# EAGLE design Ffrydiau_core (EAGLE 9.6.2)
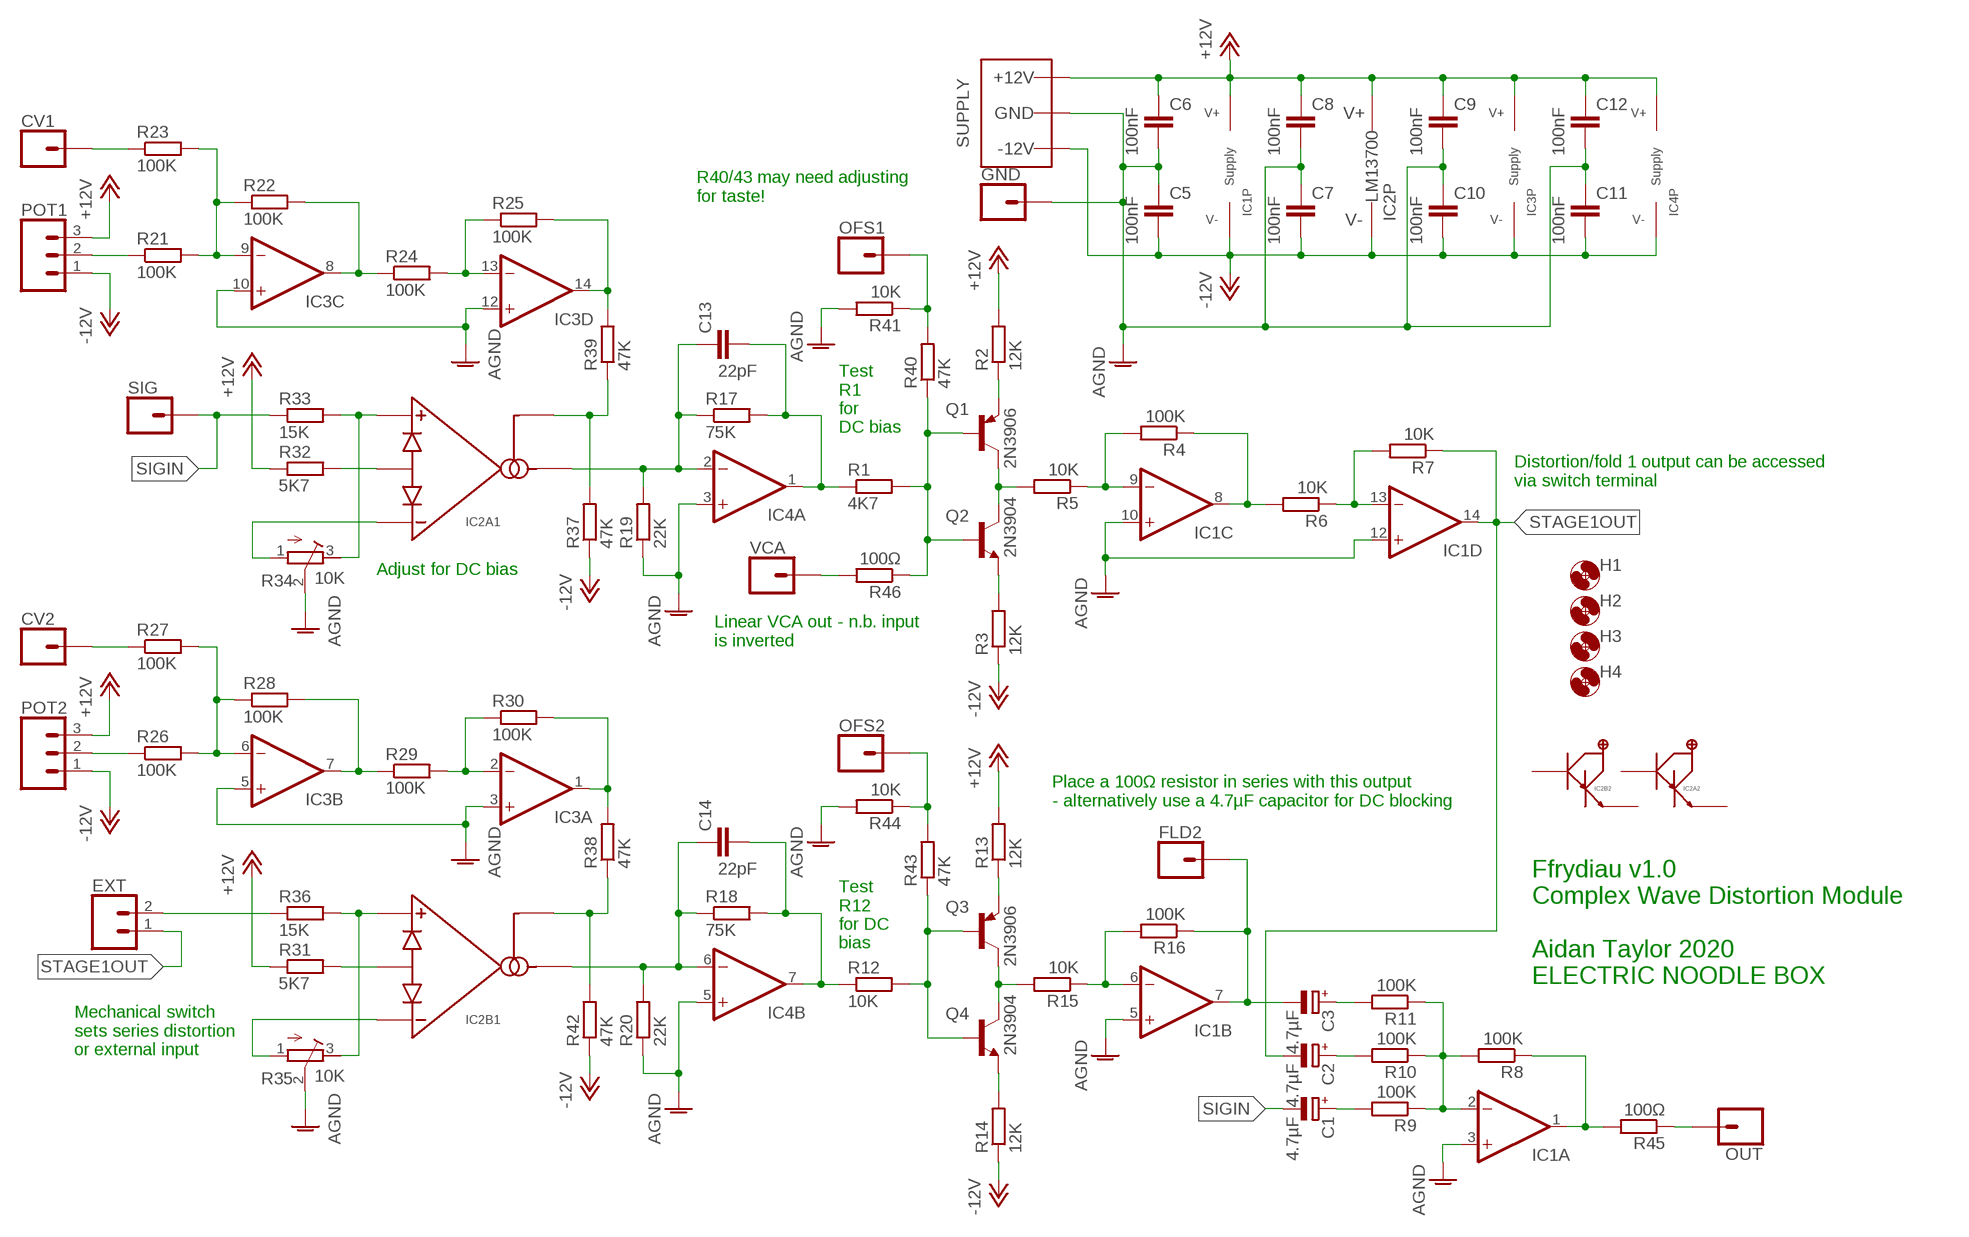
[diagram p0: schematic, sheet 1]

## Parts
C1  4.7µF  CPOL-EUE2,5-6E  [E2,5-6E]
C2  4.7µF  CPOL-EUE2,5-6E  [E2,5-6E]
C3  4.7µF  CPOL-EUE2,5-6E  [E2,5-6E]
C5  100nF  C-EU050-025X075  [C050-025X075]
C6  100nF  C-EU050-025X075  [C050-025X075]
C7  100nF  C-EU050-025X075  [C050-025X075]
C8  100nF  C-EU050-025X075  [C050-025X075]
C9  100nF  C-EU050-025X075  [C050-025X075]
C10  100nF  C-EU050-025X075  [C050-025X075]
C11  100nF  C-EU050-025X075  [C050-025X075]
C12  100nF  C-EU050-025X075  [C050-025X075]
C13  22pF  C-EU050-025X075  [C050-025X075]
C14  22pF  C-EU050-025X075  [C050-025X075]
CV1  1XWIREPAD  [1X01]
CV2  1XWIREPAD  [1X01]
EXT  2XWIREPAD  [1X02]
FLD2  1XWIREPAD  [1X01]
GND  1XWIREPAD  [1X01]
H1  MOUNT-HOLE3.2  [3,2]
H2  MOUNT-HOLE3.2  [3,2]
H3  MOUNT-HOLE3.2  [3,2]
H4  MOUNT-HOLE3.2  [3,2]
IC1  TL0X4DIL  [DIL14]
IC2  LM13700DIL  [DIL16]
IC3  TL0X4DIL  [DIL14]
IC4  TL0X2DIL  [DIL08]
OFS1  1XWIREPAD  [1X01]
OFS2  1XWIREPAD  [1X01]
OUT  1XWIREPAD  [1X01]
POT1  3XWIREPAD  [1X03]
POT2  3XWIREPAD  [1X03]
Q1  2N3906  [TO92]
Q2  2N3904  [TO92]
Q3  2N3906  [TO92]
Q4  2N3904  [TO92]
R1  4K7  R-EU_0207/10  [0207/10]
R2  12K  R-EU_0207/10  [0207/10]
R3  12K  R-EU_0207/10  [0207/10]
R4  100K  R-EU_0207/10  [0207/10]
R5  10K  R-EU_0207/10  [0207/10]
R6  10K  R-EU_0207/10  [0207/10]
R7  10K  R-EU_0207/10  [0207/10]
R8  100K  R-EU_0207/10  [0207/10]
R9  100K  R-EU_0207/10  [0207/10]
R10  100K  R-EU_0207/10  [0207/10]
R11  100K  R-EU_0207/10  [0207/10]
R12  10K  R-EU_0207/10  [0207/10]
R13  12K  R-EU_0207/10  [0207/10]
R14  12K  R-EU_0207/10  [0207/10]
R15  10K  R-EU_0207/10  [0207/10]
R16  100K  R-EU_0207/10  [0207/10]
R17  75K  R-EU_0207/10  [0207/10]
R18  75K  R-EU_0207/10  [0207/10]
R19  22K  R-EU_0207/10  [0207/10]
R20  22K  R-EU_0207/10  [0207/10]
R21  100K  R-EU_0207/10  [0207/10]
R22  100K  R-EU_0207/10  [0207/10]
R23  100K  R-EU_0207/10  [0207/10]
R24  100K  R-EU_0207/10  [0207/10]
R25  100K  R-EU_0207/10  [0207/10]
R26  100K  R-EU_0207/10  [0207/10]
R27  100K  R-EU_0207/10  [0207/10]
R28  100K  R-EU_0207/10  [0207/10]
R29  100K  R-EU_0207/10  [0207/10]
R30  100K  R-EU_0207/10  [0207/10]
R31  5K7  R-EU_0207/10  [0207/10]
R32  5K7  R-EU_0207/10  [0207/10]
R33  15K  R-EU_0207/10  [0207/10]
R34  10K  R-TRIMM3296W  [RTRIM3296W]
R35  10K  R-TRIMM3296W  [RTRIM3296W]
R36  15K  R-EU_0207/10  [0207/10]
R37  47K  R-EU_0207/10  [0207/10]
R38  47K  R-EU_0207/10  [0207/10]
R39  47K  R-EU_0207/10  [0207/10]
R40  47K  R-EU_0207/10  [0207/10]
R41  10K  R-EU_0207/10  [0207/10]
R42  47K  R-EU_0207/10  [0207/10]
R43  47K  R-EU_0207/10  [0207/10]
R44  10K  R-EU_0207/10  [0207/10]
R45  100Ω  R-EU_0207/10  [0207/10]
R46  100Ω  R-EU_0207/10  [0207/10]
SIG  1XWIREPAD  [1X01]
VCA  1XWIREPAD  [1X01]
WP1  COMBO_SUPPLY_HEADER  [COMBINED_POWER]

## Nets
+12V: C6.1 C8.1 C9.1 C12.1 IC1.4(P:V+) IC2.11(P:V+) IC3.4(P:V+) IC4.8(P:V+) POT1.3 POT2.3 R2.2 R13.2 R31.1 R32.1 WP1.V+1(V++) WP1.V+2(V++) WP1.V+3(V++)
-12V: C5.2 C7.2 C10.2 C11.2 IC1.11(P:V-) IC2.6(P:V-) IC3.11(P:V-) IC4.4(P:V-) POT1.1 POT2.1 R3.1 R14.1 R37.1 R42.1 WP1.V-1(V--) WP1.V-2(V--) WP1.V-3(V--)
AGND: C5.1 C6.2 C7.1 C8.2 C9.2 C10.1 C11.1 C12.2 GND.1 IC1.3(A:+IN) IC1.5(B:+IN) IC1.10(C:+IN) IC1.12(D:+IN) IC3.3(A:+IN) IC3.5(B:+IN) IC3.10(C:+IN) IC3.12(D:+IN) IC4.3(A:+IN) IC4.5(B:+IN) R19.1 R20.1 R34.2(S) R35.2(S) R41.2 R44.2 WP1.GND1(AGND) WP1.GND2(AGND) WP1.GND3(AGND) WP1.GND4(AGND) WP1.GND5(AGND) WP1.GND6(AGND) WP1.GND7(AGND) WP1.GND8(AGND)
N$1: Q1.2(B) Q2.2(B) R1.2 R40.1 R46.1
N$2: Q1.3(E) R2.1
N$3: Q2.3(E) R3.2
N$4: Q1.1(C) Q2.1(C) R5.2
N$5: IC1.9(C:-IN) R4.2 R5.1
N$6: IC1.8(C:OUT) R4.1 R6.2
N$7: IC1.13(D:-IN) R6.1 R7.2
N$8: OUT.1 R45.1
N$9: C13.2 IC4.1(A:OUT) R1.1 R17.2
N$10: C3.+ R11.2
N$11: C2.+ R10.2
N$12: C1.+ R9.2
N$13: IC1.2(A:-IN) R8.2 R9.1 R10.1 R11.1
N$14: IC1.1(A:OUT) R8.1 R45.2
N$15: Q3.2(B) Q4.2(B) R12.2 R43.1
N$16: Q3.3(E) R13.1
N$17: Q4.3(E) R14.2
N$18: Q3.1(C) Q4.1(C) R15.2
N$19: IC1.6(B:-IN) R15.1 R16.2
N$20: C3.- FLD2.1 IC1.7(B:OUT) R16.1
N$21: C14.1 IC2.12(B1:AMPOUT) IC4.6(B:-IN) R18.1 R20.2
N$22: C13.1 IC2.5(A1:AMPOUT) IC4.2(A:-IN) R17.1 R19.2
N$23: C14.2 IC4.7(B:OUT) R12.1 R18.2
N$24: IC3.9(C:-IN) R21.2 R22.1 R23.2
N$25: IC3.8(C:OUT) R22.2 R24.1
N$26: IC3.13(D:-IN) R24.2 R25.1
N$27: IC3.14(D:OUT) R25.2 R39.2
N$28: CV2.1 R27.1
N$29: IC3.1(A:OUT) R30.2 R38.2
N$30: POT1.2 R21.1
N$31: IC3.2(A:-IN) R29.2 R30.1
N$32: CV1.1 R23.1
N$33: IC3.7(B:OUT) R28.2 R29.1
N$34: IC3.6(B:-IN) R26.2 R27.2 R28.1
N$35: IC2.14(B1:AMP+) R35.3(E) R36.2
N$36: IC2.13(B1:AMP-) R35.1(A)
N$37: IC2.15(B1:DIODES) R31.2
N$38: IC2.2(A1:DIODES) R32.2
N$39: IC2.1(A1:AMPBIAS) R37.2 R39.1
N$40: POT2.2 R26.1
N$41: IC2.3(A1:AMP+) R33.2 R34.3(E)
N$42: IC2.4(A1:AMP-) R34.1(A)
N$43: IC2.16(B1:AMPBIAS) R38.1 R42.2
N$44: OFS1.1 R40.2 R41.1
N$45: OFS2.1 R43.2 R44.1
N$46: R46.2 VCA.1
N$47: EXT.2 R36.1
SIGIN: C1.- R33.1 SIG.1
STAGE1OUT: C2.- EXT.1 IC1.14(D:OUT) R7.1
Unconnected: IC2.7(A2:BUFF_IN) IC2.8(A2:BUFF_OUT) IC2.9(B2:BUFF_OUT) IC2.10(B2:BUFF_IN)

## Notes on the sheet
- R40/43 may need adjusting 
  for taste!
- Test
  R1
  for
  DC bias
- Distortion/fold 1 output can be accessed
  via switch terminal
- Adjust for DC bias
- Linear VCA out - n.b. input
  is inverted
- Place a 100Ω resistor in series with this output
  - alternatively use a 4.7µF capacitor for DC blocking
- Test
  R12
  for DC
  bias
- Ffrydiau v1.0
  Complex Wave Distortion Module
  
  Aidan Taylor 2020 
  ELECTRIC NOODLE BOX
- Mechanical switch
  sets series distortion
  or external input

## Library data of the parts
C1-C3 = rcl:CPOL-EU: POLARIZED CAPACITOR, European symbol; SPICEPREFIX: C
C5-C14 = rcl:C-EU: CAPACITOR, European symbol; SPICEPREFIX: C
CV1 CV2 FLD2 GND OFS1 OFS2 OUT SIG VCA = ElectricNoodleBox:1XWIREPAD
EXT = ElectricNoodleBox:2XWIREPAD
H1-H4 = holes:MOUNT-HOLE: MOUNTING HOLE with drill center marker
IC1 IC3 = ElectricNoodleBox:TL0X4: Quad Operational Amplifier; CATALOGUE: 3005140; RETAILER: Farnell
IC2 = ElectricNoodleBox:LM13700: Dual Transconductance Amplifier with Darlington Buffer; CATALOGUE: 3118206; RETAILER: Farnell
IC4 = ElectricNoodleBox:TL0X2: Dual Operational Amplifier; CATALOGUE: 1103189; RETAILER: Farnell
POT1 POT2 = ElectricNoodleBox:3XWIREPAD
Q1 Q3 = transistor-pnp:2N3906: PNP Transistor
Q2 Q4 = transistor-npn:2N3904: NPN Transistor
R1-R33 R36-R46 = rcl:R-EU_: RESISTOR, European symbol; SPICEPREFIX: R
R34 R35 = rcl:R-TRIMM: Trimm resistor; SPICEMODEL: X; SPICEPREFIXL: POT
WP1 = ElectricNoodleBox:COMBO_SUPPLY_HEADER

## Board
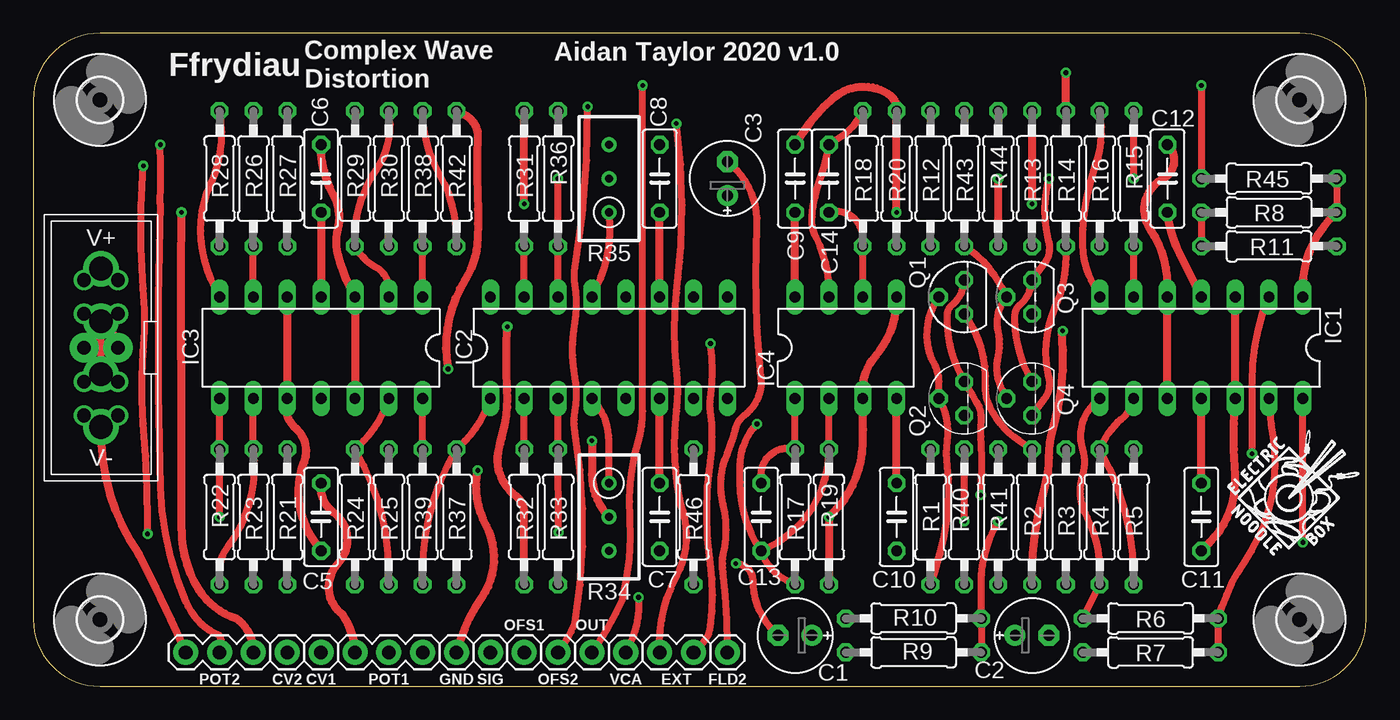
[diagram p1: board, top side]
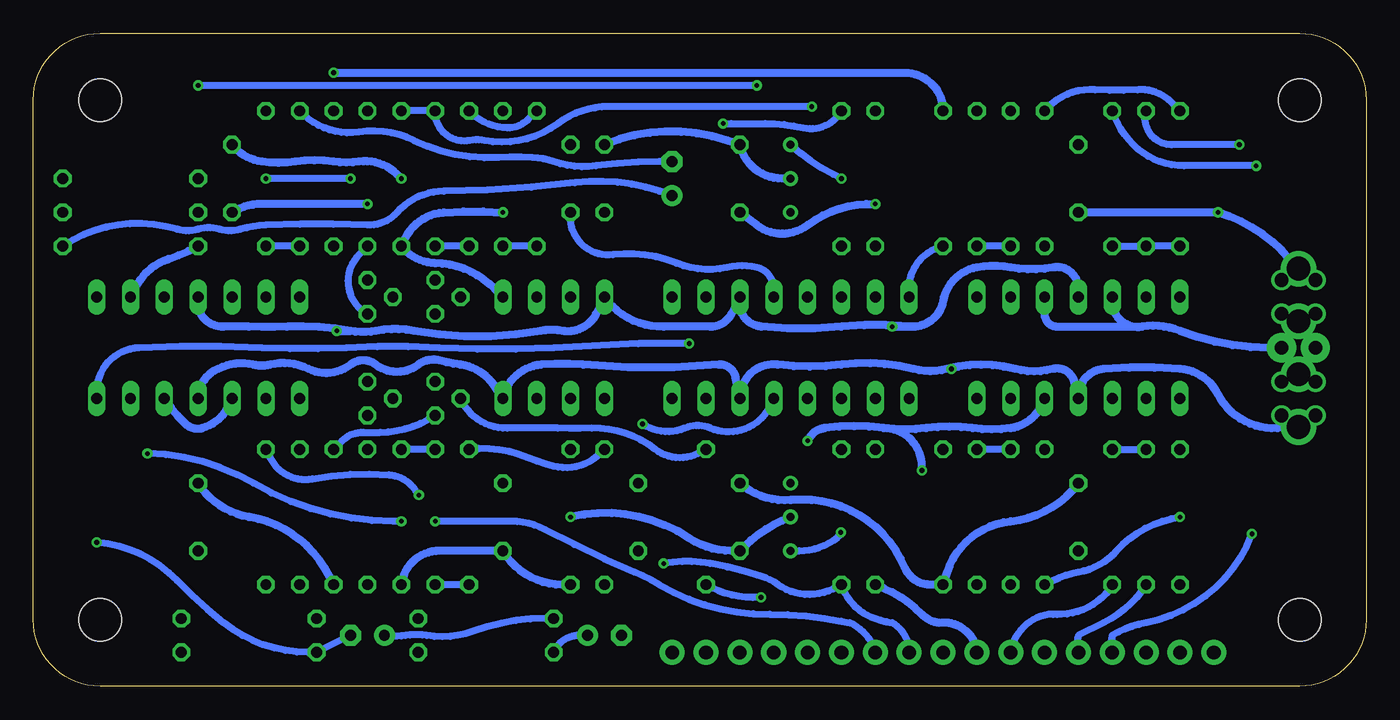
[diagram p2: board, bottom side, seen from below]

Size 100 x 49 mm. Coordinates in mm from the lower left corner, seen from the top.
Outline: 0,44 0,5 arc90 5,0 95,0 arc90 100,5 100,44 arc90 95,49 5,49 arc90 0,44
Copper layers (1*16): Top 0.035mm / dielectric 1.5mm / Bottom 0.035mm
Design rules "default": minimum track width 6mil, minimum drill 0.35mm, track to track 6mil, track to pad 6mil, pad to pad 6mil, via to via 6mil, smd to smd 6mil, copper to edge 40mil, drill to drill 6mil, minimum pad ring 10mil, minimum via ring 8mil, stop-mask expansion 4mil, vias tented up to drill 0mil, thermal gap 10mil

### Footprints (pad centres in the part's own frame; a part is rotated, then mirrored left to right if it is on the bottom)
E2,5-6E = drill 0.813 pad 1.575: + -1.27,0 | drill 0.813 pad 1.575 octagon: - 1.27,0
C050-025X075 = drill 0.813 octagon: 1 -2.54,0; 2 2.54,0
1X01 = drill 1.016 pad 1.88: 1 0,0
1X02 = drill 1.016 pad 1.88: 1 0,0; 2 2.54,0
3,2 = hole 3.2: 0,0
DIL14 = drill 0.813 long: 1 -7.62,-3.81; 2 -5.08,-3.81; 3 -2.54,-3.81; 4 0,-3.81; 5 2.54,-3.81; 6 5.08,-3.81; 7 7.62,-3.81; 8 7.62,3.81; 9 5.08,3.81; 10 2.54,3.81; 11 0,3.81; 12 -2.54,3.81; 13 -5.08,3.81; 14 -7.62,3.81
DIL16 = drill 0.813 long: 1 -8.89,-3.81; 2 -6.35,-3.81; 3 -3.81,-3.81; 4 -1.27,-3.81; 5 1.27,-3.81; 6 3.81,-3.81; 7 6.35,-3.81; 8 8.89,-3.81; 9 8.89,3.81; 10 6.35,3.81; 11 3.81,3.81; 12 1.27,3.81; 13 -1.27,3.81; 14 -3.81,3.81; 15 -6.35,3.81; 16 -8.89,3.81
DIL08 = drill 0.813 long: 1 -3.81,-3.81; 2 -1.27,-3.81; 3 1.27,-3.81; 4 3.81,-3.81; 5 3.81,3.81; 6 1.27,3.81; 7 -1.27,3.81; 8 -3.81,3.81
1X03 = drill 1.016 pad 1.88: 1 0,0; 2 2.54,0; 3 5.08,0
TO92 = drill 0.813 octagon: 1 1.27,0; 2 0,1.905; 3 -1.27,0
0207/10 = drill 0.813 octagon: 1 -5.08,0; 2 5.08,0
RTRIM3296W = drill 0.61: 1 0,-2.54; 2 0,0; 3 0,2.54
COMBINED_POWER = drill 1.78: GND1 -1.98,0; GND2 1.98,0; V+1 -5.94,0; V-1 5.94,0 | drill 1.016: GND3 -2.54,1.27; GND5 2.54,1.27; GND6 -2.54,-1.27; GND8 2.54,-1.27; V+2 -5.08,1.27; V+3 -5.08,-1.27; V-2 5.08,1.27; V-3 5.08,-1.27 | drill 1.016 pad 2.184: GND4 0,1.27; GND7 0,-1.27

### Placement (x,y rotation side)
C1  57.15,3.81 180 top
C2  74.93,3.81 0 top
C3  52.07,38.1 90 top
C5  21.59,12.7 90 top
C6  21.59,38.1 90 top
C7  46.99,12.7 90 top
C8  46.99,38.1 90 top
C9  57.15,38.1 90 top
C10  64.77,12.7 90 top
C11  87.63,12.7 90 top
C12  85.09,38.1 90 top
C13  54.61,12.7 90 top
C14  59.69,38.1 90 top
CV1  21.59,2.54 90 top
CV2  19.05,2.54 90 top
EXT  49.53,2.54 180 top
FLD2  52.07,2.54 90 top
GND  31.75,2.54 90 top
H1  95,44 0 top
H2  95,5 0 top
H3  5,44 0 top
H4  5,5 0 top
IC1  87.63,25.4 180 top
IC2  43.18,25.4 0 top
IC3  21.59,25.4 180 top
IC4  60.96,25.4 0 top
OFS1  36.83,2.54 270 top
OFS2  39.37,2.54 90 top
OUT  41.91,2.54 270 top
POT1  24.13,2.54 0 top
POT2  11.43,2.54 0 top
Q1  69.85,29.21 90 top
Q2  69.85,21.59 90 top
Q3  74.93,29.21 90 top
Q4  74.93,21.59 90 top
R1  20K  [0207/10]  67.31,12.7 270 top
R2  74.93,12.7 270 top
R3  77.47,12.7 90 top
R4  80.01,12.7 90 top
R5  82.55,12.7 90 top
R6  83.82,5.08 180 top
R7  83.82,2.54 0 top
R8  92.71,35.56 180 top
R9  66.04,2.54 180 top
R10  66.04,5.08 180 top
R11  92.71,33.02 0 top
R12  20K  [0207/10]  67.31,38.1 270 top
R13  74.93,38.1 90 top
R14  77.47,38.1 270 top
R15  82.55,38.1 90 top
R16  47K  [0207/10]  80.01,38.1 270 top
R17  57.15,12.7 90 top
R18  62.23,38.1 90 top
R19  59.69,12.7 90 top
R20  64.77,38.1 270 top
R21  19.05,12.7 90 top
R22  13.97,12.7 90 top
R23  16.51,12.7 90 top
R24  24.13,12.7 90 top
R25  26.67,12.7 90 top
R26  16.51,38.1 270 top
R27  19.05,38.1 270 top
R28  13.97,38.1 90 top
R29  24.13,38.1 270 top
R30  26.67,38.1 270 top
R31  36.83,38.1 270 top
R32  36.83,12.7 90 top
R33  39.37,12.7 90 top
R34  43.18,12.7 180 top
R35  43.18,38.1 0 top
R36  39.37,38.1 270 top
R37  31.75,12.7 90 top
R38  29.21,38.1 270 top
R39  29.21,12.7 90 top
R40  69.85,12.7 90 top
R41  72.39,12.7 270 top
R42  31.75,38.1 270 top
R43  69.85,38.1 90 top
R44  72.39,38.1 270 top
R45  92.71,38.1 0 top
R46  49.53,12.7 270 top
SIG  34.29,2.54 90 top
U$1  [LOGO10X10]  89.53,9.53 0 top
VCA  44.45,2.54 90 top
WP1  5.08,25.4 270 top

### Tracks (layer width: path | path; a pad name or v marks a point on that pad's centre or on a via)
+12V  (via drill 0.35)
  Top 0.508: WP1.V+2 5.94,30.48 WP1.V+1 4.22,30.48 WP1.V+3
  Top 0.61: v11.11,35.56 arc1 11.11,22.23 arc-1 11.11,11.75 arc33 12.38,7.3 arc40 15.24,5.08 arc-54 POT2.3 | C6.1 IC3.4 | R2.2 74.93,8.26 arc-16 75.88,14.92 arc16 76.2,17.14 arc-16 76.52,19.37 arc23 77.15,26.67 arc-203 v77.23,26.66 | IC2.11 C8.1 | IC4.8 C9.1 | C12.1 arc20 86.04,32.38 IC1.4 | v36.83,36.2 R31.1 | R13.2 v74.93,36.2 | R32.1 36.83,13.02 arc53 36.2,14.29 arc-66 34.92,17.78 arc-2 35.24,19.05 arc18 35.56,22.23 arc-7 v35.56,26.99
  Bottom 0.61: C6.1 v11.11,35.56 arc32 5.71,32.07 WP1.V+1 | R32.1 arc25 33.34,5.4 arc-37 32.07,4.76 arc93 POT1.3 | IC3.4 21.59,29.84 arc-100 23.5,31.43 arc21 26.67,31.43 arc-21 29.21,31.43 arc-69 31.75,28.89 arc85 34.29,26.99 | 34.29,26.99 arc-12 39.37,26.99 arc12 45.4,26.99 arc97 IC2.11 47.62,27.94 arc65 49.21,26.99 arc-3 52.7,26.99 arc56 IC4.8 57.78,27.94 arc74 60.33,26.67 arc-21 61.91,26.67 arc21 71.44,26.67 arc-21 74.3,26.67 arc21 76.2,26.67 | 76.2,26.67 arc-13 80.96,26.99 arc5 83.82,26.99 arc-5 85.72,26.99 arc104 IC1.4 | v77.23,26.66 76.2,26.67 | C8.1 45.72,34.61 arc-74 41.91,34.61 arc39 v36.83,36.2 | v74.93,36.2 82.87,36.2 arc-32 C12.1 | v35.56,26.99 34.29,26.99
-12V  (via drill 0.35)
  Top 0.508: WP1.V-1 4.67,19.46 WP1.V-3
  Top 0.61: WP1.V-1 arc36 7.94,9.84 arc-3 POT2.1 | C5.2 arc60 22.54,13.02 arc-97 22.86,9.21 arc97 23.18,5.4 arc-31 POT1.1 | C7.2 IC2.6 | C10.2 IC4.4 | C11.2 IC1.11 | R42.1 32.38,42.86 arc-65 33.34,41.27 arc3 33.34,36.83 arc-3 33.34,33.66 arc-30 32.38,30.48 arc42 v31.11,23.81 | R14.1 v77.47,46.04
  Bottom 0.61: C5.2 arc47 26.67,12.38 arc-66 31.43,8.57 R37.1 32.7,7.62 arc67 34.61,8.89 arc-63 41.59,13.97 arc-9 43.18,13.97 arc46 C7.2 | WP1.V-2 WP1.V-1 6.67,19.37 arc66 11.11,21.91 arc-58 13.97,23.81 arc-9 19.68,23.81 arc-90 IC3.11 21.91,22.86 arc-90 23.5,23.81 arc28 26.35,23.81 arc-28 31.43,23.81 | 31.43,23.81 arc28 33.97,23.81 arc-21 39.37,24.13 arc15 44.13,24.13 arc-98 IC2.6 47.31,23.18 arc-84 48.58,24.13 arc10 58.74,24.13 arc-10 61.91,24.13 arc-73 IC4.4 65.41,22.54 arc-49 67.94,24.13 arc7 69.53,24.45 arc-52 71.12,24.13 arc75 74.3,24.13 arc-75 76.2,24.13 arc64 79.38,23.81 arc-40 82.23,24.13 arc27 83.5,24.13 arc-49 86.68,23.5 arc-55 IC1.11 | R3.1 77.79,8.26 arc-54 83.82,12.7 arc49 C11.2 | v31.11,23.81 31.43,23.81 | v77.47,46.04 34.61,46.04 arc90 R42.1
AGND  (via drill 0.35)
  Top 0.508: WP1.GND2 4.52,22.86 WP1.GND8 | WP1.GND2 5.79,23.42 WP1.GND5 | WP1.GND2 WP1.GND1 | WP1.GND1 6.35,26.11 WP1.GND4 | WP1.GND1 5.08,26.67 WP1.GND7 | WP1.GND1 4.37,27.38 WP1.GND6 | WP1.GND1 5.79,27.38 WP1.GND3
  Top 0.61: C5.1 20.95,11.11 arc-55 20.32,16.83 arc70 19.68,19.37 arc-66 IC3.10 IC3.5 | R19.1 v59.69,12.7 60.01,13.02 arc43 62.23,18.1 arc5 IC4.3 62.23,22.23 arc-41 63.18,24.77 arc43 IC4.5 | IC3.12 IC3.3 23.81,29.84 arc-12 22.86,32.38 arc-29 22.86,34.29 arc43 22.54,36.83 arc-30 C6.2 | R34.2 arc-44 41.91,15.88 v41.91,18.41 | C11.1 88.27,10.79 arc49 90.17,15.88 arc-8 IC1.12 IC1.3 | IC1.10 IC1.5 85.09,30.16 arc34 83.82,34.29 arc-96 84.77,38.1 arc110 C12.2 | v64.77,35.56 R20.1 arc62 64.14,44.45 arc74 60.01,44.13 arc15 57.78,41.59 C9.2 | R44.2 v72.39,38.1 | GND.1 32.07,3.49 arc-16 33.66,6.67 arc63 33.97,12.06 arc-38 v33.34,16.19
  Bottom 0.61: R34.2 arc-25 46.67,10.48 C7.1 47.62,10.16 arc33 50.8,11.11 arc-47 v59.69,12.7 | R19.1 60.33,7.62 arc59 C10.1 69.53,10.16 arc-83 R41.2 | WP1.GND4 7.3,25.4 arc22 13.97,26.67 arc-30 16.83,26.99 | IC3.5 arc-108 16.83,26.99 | IC3.3 24.13,27.94 arc-90 23.18,26.99 16.83,26.99 | IC3.12 24.45,20.95 arc56 26.67,19.37 arc15 29.53,19.37 arc-15 33.02,19.37 arc15 36.2,19.37 | 36.2,19.37 arc-15 40.64,19.37 arc-58 v41.91,18.41 | IC1.10 85.41,20.95 arc47 87.31,19.37 arc60 88.58,19.68 arc12 IC1.12 | IC4.5 65.41,29.84 arc-44 69.85,31.75 arc50 R44.2 72.07,33.66 arc59 69.22,35.56 arc8 v64.77,35.56 | R35.2 43.81,38.1 arc77 C8.2 47.94,40.96 arc-41 C9.2 | v72.39,38.1 72.71,38.42 arc-53 75.56,39.37 arc16 77.47,39.37 arc-16 80.33,39.37 arc16 82.87,39.37 arc43 C12.2 | v33.34,16.19 33.34,16.51 arc-90 36.2,19.37
N$1
  Top 0.508: R1.2 67.63,8.57 arc11 68.58,12.7 arc15 68.58,16.51 arc-15 68.58,18.41 arc38 Q2.2 67.94,22.86 arc28 67.63,24.13 arc-63 Q1.2
  Bottom 0.508: R1.2 R40.1 | R46.1 50.16,17.46 arc65 53.34,17.78 arc-39 58.1,19.37 arc2 60.64,19.37 arc-2 64.45,19.37 arc67 Q2.2
N$2
  Top 0.508: R2.1 73.98,18.41 arc-30 71.75,20.95 arc-30 71.44,22.54 arc40 Q1.3
N$3
  Bottom 0.508: R3.2 76.83,18.41 arc46 75.25,19.05 arc-3 73.98,19.05 arc-31 Q2.3
N$4  (via drill 0.35)
  Top 0.508: v71.08,14.35 71.12,15.24 arc6 71.12,18.1 arc-6 71.12,20 arc34 70.8,21.27 arc0 Q2.1 69.53,23.5 arc-29 68.58,27.94 arc-48 68.9,28.57 arc48 Q1.1
  Bottom 0.508: R5.2 82.23,17.14 arc-74 79.06,15.56 arc14 73.34,15.88 arc63 71.12,14.29 arc-243 v71.08,14.35
N$5
  Top 0.508: R5.1 82.55,8.26 arc30 R4.2 80.33,18.41 arc-24 81.6,20 arc40 IC1.9
N$6
  Top 0.508: R6.2 R4.1 80.01,8.89 arc28 79.06,12.7 arc-45 78.74,15.88 arc33 78.74,17.78 arc-70 IC1.8
N$7
  Top 0.508: R7.2 R6.1 89.22,6.03 arc-16 90.81,9.21 arc43 93.03,18.73 arc-4 IC1.13
N$8  (via drill 0.35)
  Top 0.508: v45.72,45.09 45.72,20.64 arc-16 45.4,18.41 arc20 44.77,12.7 arc-17 44.2,6.47 arc-9 42.55,3.49 OUT.1 | v87.63,45.09 R45.1
  Bottom 0.508: v45.72,45.09 v87.63,45.09
N$9
  Top 0.508: C13.2 54.61,15.88 arc-106 R17.2 IC4.1
  Bottom 0.508: R17.2 57.47,17.46 arc59 60.96,16.51 arc8 62.87,17.14 arc-29 R1.1
N$10
  Bottom 0.508: C3.+ 53.02,37.15 arc-25 59.37,37.78 arc7 69.22,37.15 arc-48 72.71,35.56 arc51 74.93,34.61 arc-4 82.55,34.61 arc-15 84.45,34.29 arc34 86.04,34.29 arc-34 87.63,34.29 arc34 89.22,34.29 arc-50 R11.2
N$11
  Bottom 0.508: R10.2 61.59,5.08 arc-20 66.99,4.13 arc30 70.48,3.81 arc-19 72.07,3.81 arc19 C2.+
N$12
  Bottom 0.508: C1.+ 59.05,3.81 arc-67 R9.2
N$13  (via drill 0.35)
  Top 0.508: R9.1 R10.1 71.12,7.62 arc-31 v72.39,12.38 | v91.44,17.46 91.44,22.86 arc-23 IC1.2 | R8.2 R11.1
  Bottom 0.508: v72.39,12.38 73.03,12.38 arc31 83.5,15.24 arc-30 v91.44,17.46
  Bottom 0.61: IC1.2 92.39,29.84 arc44 89.85,32.07 arc-9 R11.1
N$14
  Top 0.508: R45.2 R8.1
  Top 0.61: IC1.1 95.25,29.84 arc-48 R8.1
N$15
  Top 0.508: Q4.2 72.71,22.23 arc-39 72.39,24.77 arc25 72.39,26.67 arc-53 Q3.2 72.71,29.84 arc31 R43.1
  Bottom 0.508: R12.2 R43.1
N$16
  Bottom 0.508: R13.1 75.56,32.38 arc-106 Q3.3
N$17
  Top 0.508: Q4.3 75.88,21.59 arc51 76.2,23.18 arc-29 76.2,26.99 arc-8 76.83,28.89 arc28 R14.2
N$18  (via drill 0.35)
  Top 0.508: Q4.1 74.61,23.5 arc-29 73.66,27.94 arc-48 73.98,28.57 arc48 Q3.1 75.88,31.75 arc51 76.2,33.34 arc-29 v76.2,38.1 | v82.55,38.1 R15.2
  Bottom 0.508: v76.2,38.1 v82.55,38.1
N$19
  Top 0.508: IC1.6 R15.1
  Bottom 0.508: R16.2 R15.1
N$20
  Top 0.508: IC1.7 79.38,30.48 arc-25 78.74,33.02 arc-21 79.69,39.05 arc30 R16.1 | C3.- arc-56 54.29,34.61 arc9 54.61,23.18 arc-60 53.34,20.32 arc40 52.7,19.37 arc-10 52.07,17.46 arc37 51.75,13.65 arc-28 51.75,9.84 arc13 51.75,8.57 arc-7 52.07,3.17 FLD2.1
  Bottom 0.508: C3.- 53.02,39.37 arc-8 57.78,39.05 arc27 60.96,39.37 arc-15 62.55,39.69 arc-7 65.09,39.69 arc30 71.44,40.96 arc-35 75.56,41.59 arc57 R16.1
N$21
  Top 0.508: IC4.6 R18.1 62.23,33.66 arc106 C14.1
  Bottom 0.508: IC2.12 44.45,29.84 arc-77 45.72,31.43 arc-25 47.94,31.43 arc35 51.75,31.75 arc-29 56.52,32.38 arc104 C14.1 | R18.1 R20.2
N$22  (via drill 0.35)
  Top 0.508: R17.1 56.52,7.94 arc-46 C13.1 | C13.1 55.24,10.48 arc64 R19.2 IC4.2 | C13.1 arc-34 53.02,15.32 53.02,16.51 arc-44 v54.29,19.68
  Bottom 0.508: IC2.5 44.77,20.95 arc53 47.18,19.14 arc33 49.21,19.37 arc-46 51.12,19.37 arc57 v54.29,19.68
N$23
  Top 0.508: IC4.7 59.69,29.84 arc28 58.74,33.66 arc-34 58.42,35.24 arc-14 59.05,38.1 arc11 C14.2 60.64,41.27 arc33 R18.2
  Bottom 0.508: R18.2 62.87,42.55 arc46 64.45,41.91 arc45 R12.1
N$24
  Top 0.508: R22.1 13.97,8.57 arc-37 14.61,10.48 arc44 R23.2 IC3.9
  Bottom 0.508: R21.2 R23.2
N$25  (via drill 0.35)
  Top 0.508: v13.97,12.7 R22.2 IC3.8
  Bottom 0.508: R24.1 23.5,7.94 arc16 21.59,8.57 arc-37 18.73,10.16 arc39 v13.97,12.7
N$26
  Top 0.508: R25.1 26.67,8.57 arc31 R24.2 24.77,18.41 arc28 IC3.13
N$27
  Top 0.508: R39.2 IC3.14
  Bottom 0.508: R25.2 R39.2
N$28  (via drill 0.35)
  Top 0.508: v8.57,11.43 8.57,12.38 arc5 8.26,19.68 arc-10 8.26,25.08 arc10 8.26,29.84 arc-10 v8.26,39.05
  Bottom 0.508: v8.57,11.43 arc58 16.51,4.76 arc-19 19.05,3.81 arc-30 CV2.1 | R27.1 arc-26 17.46,40.64 arc-45 13.65,39.05 v8.26,39.05
N$29
  Top 0.508: IC3.1 R38.2
  Bottom 0.508: R30.2 R38.2
N$30
  Bottom 0.508: R21.1 arc57 22.86,5.4 arc3 23.81,5.4 arc-72 POT1.2
N$31
  Top 0.508: IC3.2 26.67,29.84 arc62 25.72,31.43 arc-34 R29.2 24.13,33.66 arc-35 25.72,38.73 arc45 R30.1
N$32
  Bottom 0.508: R23.1 arc31 19.68,4.76 21.59,3.81 arc-37 CV1.1
N$33
  Top 0.508: IC3.7 13.65,29.84 arc-16 12.7,32.7 arc-35 13.34,37.78 arc36 R28.2
  Bottom 0.508: R28.2 14.61,43.81 arc-49 17.14,44.77 arc8 20.32,44.77 arc-53 R29.1
N$34
  Top 0.508: IC3.6 R26.2
  Bottom 0.508: R28.1 R26.2 R27.2
N$35  (via drill 0.35)
  Top 0.508: IC2.14 R36.2 v39.37,38.1
  Bottom 0.508: v39.37,38.1 40.01,38.42 arc17 R35.3
N$36
  Top 0.508: IC2.13 42.23,29.84 arc34 R35.1
N$37
  Top 0.508: IC2.15 R31.2
N$38
  Top 0.508: R32.2 IC2.2
N$39
  Top 0.508: R39.1 29.21,8.57 arc-31 R37.2 32.38,18.41 arc28 IC2.1
N$40  (via drill 0.35)
  Top 0.508: v9.53,40.64 arc-4 9.53,36.2 arc4 9.53,14.92 arc21 11.43,6.35 arc44 13.97,3.81 arc-44 POT2.2
  Bottom 0.508: R26.1 arc-106 14.61,40.64 v9.53,40.64
N$41  (via drill 0.35)
  Top 0.508: v39.41,11.54 R33.2 IC2.3
  Bottom 0.508: R34.3 42.55,10.16 arc-44 39.37,11.43 arc-136 v39.41,11.54
N$42
  Top 0.508: IC2.4 arc-44 43.18,18.41 R34.1
N$43
  Top 0.508: R42.2 31.75,33.66 arc30 30.48,38.42 arc-30 R38.1
  Bottom 0.508: IC2.16 34.29,29.84 arc77 R42.2
N$44  (via drill 0.35)
  Top 0.508: v69.85,12.38 R40.2
  Bottom 0.508: v69.85,12.38 arc0 64.14,12.38 arc28 61.59,11.75 arc-5 54.93,8.57 arc8 53.02,7.62 arc-31 44.77,5.4 arc10 40.64,5.08 arc1 38.73,4.76 arc51 OFS1.1 | R40.2 R41.1
N$45  (via drill 0.35)
  Top 0.508: v41.59,43.5 arc-10 40.64,31.43 arc19 40.64,30.16 arc-19 40.64,27.3 arc19 40.64,23.18 arc-19 40.64,20.64 arc19 40.64,19.05 arc-19 40.64,4.76 arc-14 40.01,3.49 OFS2.1
  Bottom 0.508: v41.59,43.5 56.83,43.5 arc-37 60.64,42.23 arc48 66.15,40.96 arc-22 67.26,40.96 arc103 R43.2 R44.1
N$46  (via drill 0.35)
  Top 0.508: VCA.1 44.77,3.17 arc33 v45.4,6.67
  Bottom 0.508: v45.4,6.67 46.04,6.67 arc31 R46.2
N$47  (via drill 0.35)
  Top 0.508: v48.25,42.23 arc-168 v48.26,42.23 arc-12 48.58,33.02 arc-3 48.26,29.53 arc13 48.26,23.81 arc-13 48.26,20.64 arc18 48.58,13.65 arc-49 48.26,8.26 arc28 46.99,3.17 EXT.2
  Bottom 0.508: v48.25,42.23 47.62,42.23 45.09,42.23 arc13 42.23,41.91 arc-73 R36.1
SIGIN  (via drill 0.35)
  Top 0.508: v52.7,9.21 arc-90 53.98,7.94 arc50 C1.-
  Bottom 0.508: SIG.1 arc-62 35.56,4.76 arc7 36.83,5.08 arc54 R33.1 40.01,7.3 arc62 44.13,7.62 arc-18 45.4,8.26 arc-7 49.21,9.21 arc-21 v52.7,9.21
STAGE1OUT  (via drill 0.35)
  Top 0.508: v95.25,10.79 IC1.14 | EXT.1 50.16,3.17 arc37 50.8,4.45 arc16 50.8,9.21 arc-16 50.8,16.83 arc16 50.8,20.64 arc-16 50.8,21.59 arc16 v50.8,25.72
  Bottom 0.508: v95.25,10.79 arc41 89.22,7.94 arc-7 85.72,4.76 arc-39 79.38,2.54 R7.1 C2.- | IC1.14 arc95 92.08,25.4 arc6 82.87,25.4 arc-6 76.52,25.4 arc6 69.53,25.4 arc-6 60.96,25.4 54.61,25.72 v50.8,25.72

### Text on the board
tPlace: Aidan Taylor 2020 v1.0 | Ffrydiau | Complex Wave / Distortion